# Altium schematic sheet ADC088S022.SchDoc
size A4; SheetNumber: 6; SheetTotal: 7
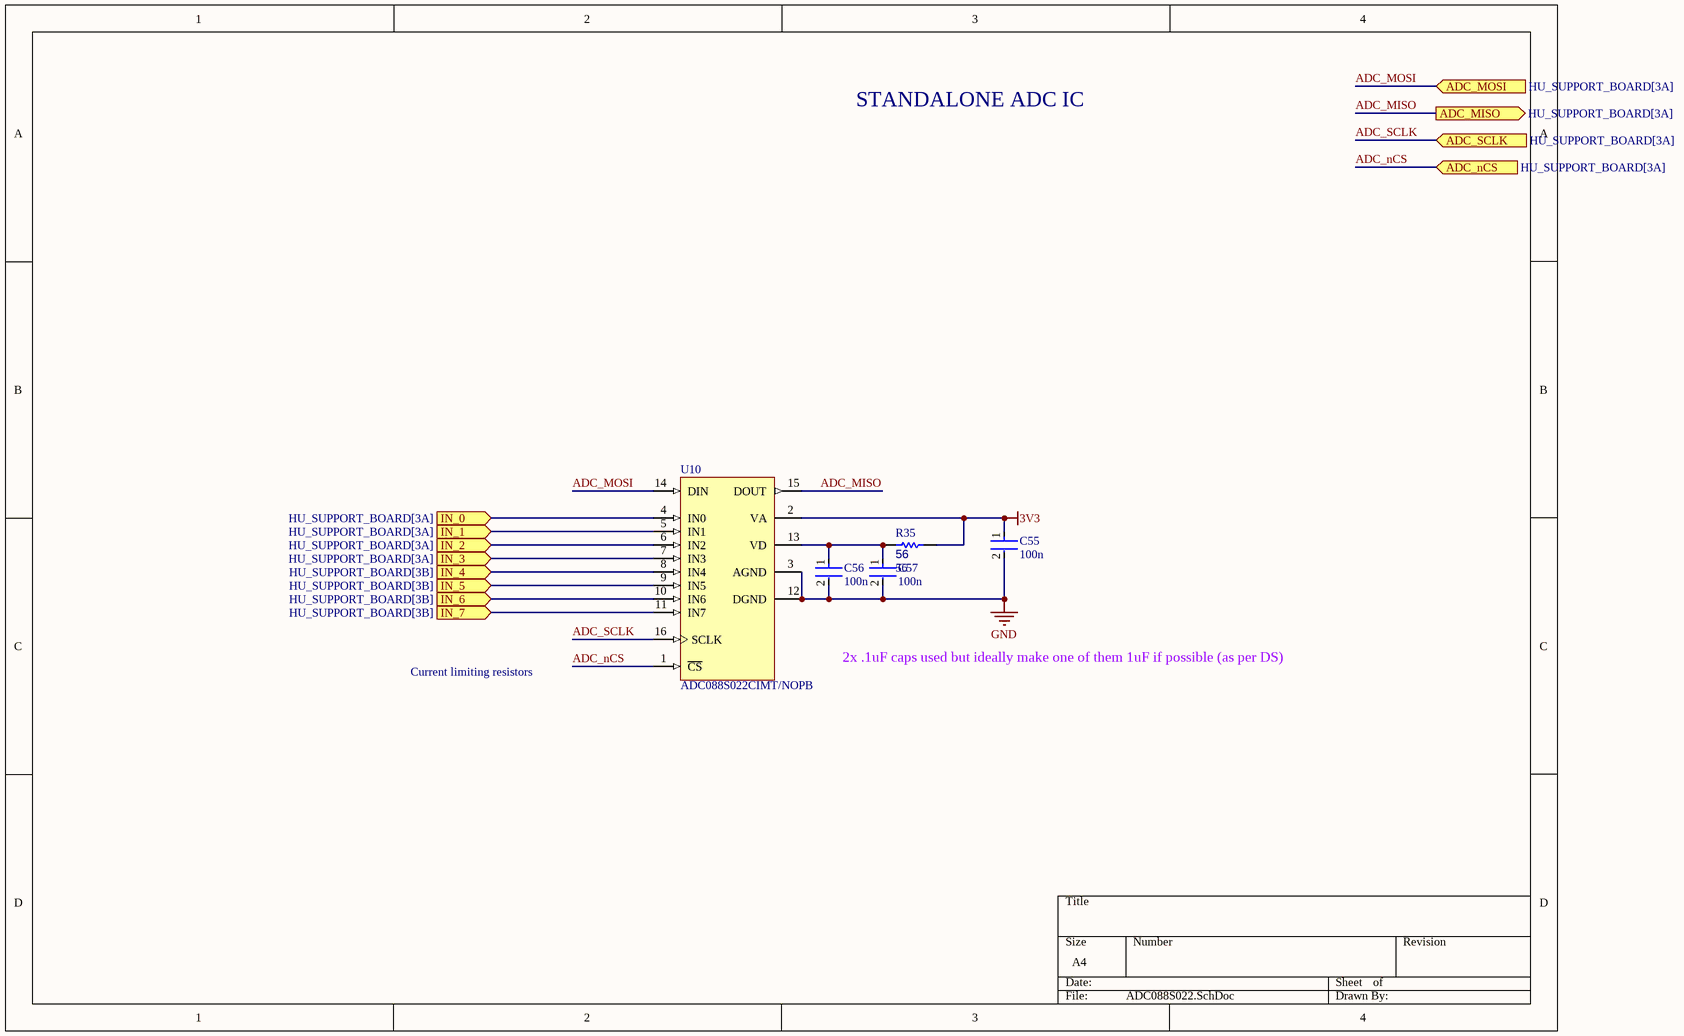
[diagram p0: ADC088S022.SchDoc]

## Parts
C55  100n  [FP-0402-L_1_0_0_05-W_0_5-IPC_A]
C56  100n  [FP-0402-L_1_0_0_05-W_0_5-IPC_A]
C57  100n  [FP-0402-L_1_0_0_05-W_0_5-IPC_A]
R35  56  [R0603B]
U10  ADC088S022CIMT/NOPB  [MTC16_L]

## Ports
ADC_MISO (out, see HU_SUPPORT_BOARD[3A]), ADC_MOSI (in, see HU_SUPPORT_BOARD[3A]), ADC_nCS (in, see HU_SUPPORT_BOARD[3A]), ADC_SCLK (in, see HU_SUPPORT_BOARD[3A]), IN_0 (in, see HU_SUPPORT_BOARD[3A]), IN_1 (in, see HU_SUPPORT_BOARD[3A]), IN_2 (in, see HU_SUPPORT_BOARD[3A]), IN_3 (in, see HU_SUPPORT_BOARD[3A]), IN_4 (in, see HU_SUPPORT_BOARD[3B]), IN_5 (in, see HU_SUPPORT_BOARD[3B]), IN_6 (in, see HU_SUPPORT_BOARD[3B]), IN_7 (in, see HU_SUPPORT_BOARD[3B])

## Nets
3V3: C55.1 R35.1 U10.2(VA)
GND: C55.2 C56.2 C57.2 U10.3(AGND) U10.12(DGND)
ADC_MISO: U10.15(DOUT) ; port ADC_MISO
ADC_MOSI: U10.14(DIN) ; port ADC_MOSI
ADC_nCS: U10.1(~{CS}) ; port ADC_nCS
ADC_SCLK: U10.16(SCLK) ; port ADC_SCLK
IN_0: U10.4(IN0) ; port IN_0
IN_1: U10.5(IN1) ; port IN_1
IN_2: U10.6(IN2) ; port IN_2
IN_3: U10.7(IN3) ; port IN_3
IN_4: U10.8(IN4) ; port IN_4
IN_5: U10.9(IN5) ; port IN_5
IN_6: U10.10(IN6) ; port IN_6
IN_7: U10.11(IN7) ; port IN_7
NetC56_1: C56.1 C57.1 R35.2 U10.13(VD)

## Notes on the sheet
- STANDALONE ADC IC
- Current limiting resistors
- 2x .1uF caps used but ideally make one of them 1uF if possible (as per DS)

## Library data of the parts
C55-C57 = CMP-001-00058-1: LARGE PADS, 0402 CAP, CHANGE COMMENT TO MATCH REAL P/N; Capacitor Type: Ceramic; Min Operating Temperature: -55°C; Mounting Technology: Surface Mount; Pins: 2; Case/Package: 0402; RoHS Compliant: Yes; Max Operating Temperature: 85°C
R35 = CMP-009-00002-14: Resistor; Value: 56
U10 = CMP-0054-00372-2: 8-Channel, 50 kSPS to 200 kSPS, 8-Bit A/D Converter, 16-pin TSSOP, Pb-Free; Manufacturer: National Semiconductor; PackageTopMarking: NSUZXYTT*88S022*CIMT; CompType: ADC IC; PowerWise: Y; ComponentLink2URL: http://www.national.com/pf/AD/ADC088S022.html; RoHS: Y; PackageDescription: Molded TSSOP, Jedec, 5 x 4.4 x 0.9mm Body, 16 Lead, 0.65mm Pitch; DatasheetVersion: Feb-2010; PinCount: 16; ComponentLink1Description: ADC088S022 Datasheet; Code_JEDEC: MO-153-AB; ComponentLink3URL: http://www.national.com/packaging/folders/mtc16.html; PackageVersion: revD, Jun-2003; ComponentLink3Description: MTC16 Package Page; RevisionNote: Component URLs added; ComponentLink1URL: http://www.national.com/ds/AD/ADC088S022.pdf; ComponentLink2Description: ADC088S022 Web Page; PackageReference: MTC16